# Altium schematic sheet Heated bed.SchDoc: Heated bed
size A4; DrawnBy: oaba200
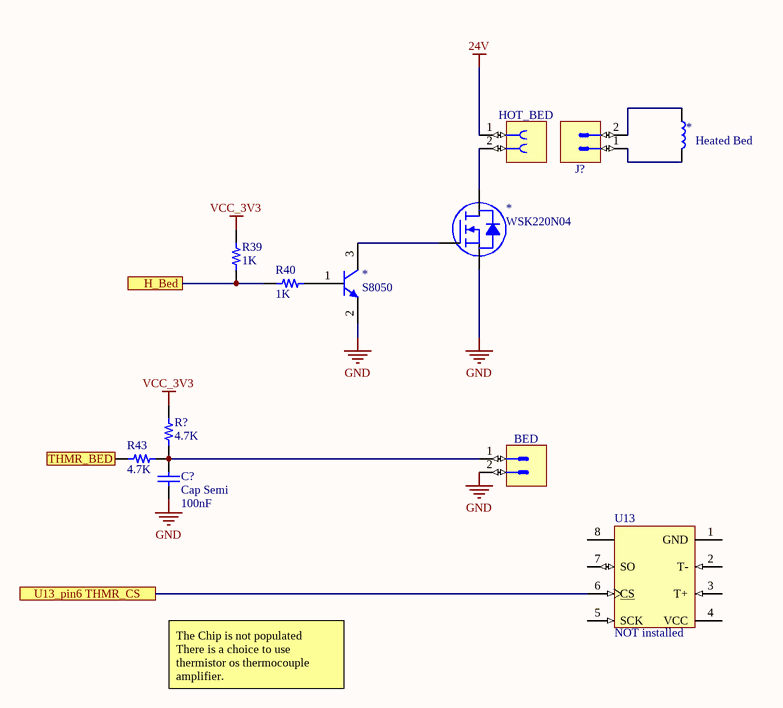
[diagram p0: Heated bed.SchDoc]

## Parts
(Parts that share a designator on the sheet are numbered #1, #2 ... from top to bottom, then left to right.)
*#1  Heated Bed
*#2  WSK220N04  [TO263]
*#3  S8050  [SOT23]
BED  (no value)
C?  Cap Semi  value 100nF  [C1206]
HOT_BED  (no value)
J?  (no value)
R39  1K
R40  1K
R43  4.7K  [RES 0805_2012]
R?  4.7K  [RES 0805_2012]
U13  NOT installed  [SOIC8]

## Ports
H_Bed, THMR_BED, U13_pin6 THMR_CS

## Nets
24V: HOT_BED.1
GND: *#2.2(S) *#3.2(E) BED.2 C?.2
VCC_3V3: R39.2 R?.1
H_Bed: R39.1 R40.1 ; port H_Bed
THMR_BED: R43.1 ; port THMR_BED
U13_pin6 THMR_CS: U13.6(CS) ; port U13_pin6 THMR_CS
Net*#1_1: *#1.1 J?.2
Net*#1_2: *#1.2 J?.1
Net*#2_1: *#2.1(G) *#3.3(C)
Net*#2_3: *#2.3(D) HOT_BED.2
Net*#3_1: *#3.1(B) R40.2
NetBED_1: BED.1 C?.1 R43.2 R?.2

Not connected (* = marked no-connect by the designer): U13 1(GND) 2(T-) 3(T+) 4(VCC) 5(SCK) 7(SO) 8

## Notes on the sheet
- The Chip is not populated
  There is a choice to use thermistor os thermocouple amplifier.
  The output is common with both IC. Only the Chipselest separate.

## Library data of the parts
*#1 = Heater coil
*#2 = WSK220N04: N-Ch MOSFET / 40V  220A
BED J? = Connector 2 Male
C? = Cap Semi: Capacitor (Semiconductor SIM Model); Published: 8-Jun-2000; LatestRevisionDate: 29-May-2009; LatestRevisionNote: IPC-7351 Footprint Added.; PackageReference: C1206; Publisher: Altium Limited; PackageDescription: Chip Capacitor
HOT_BED = Connector 2 Female
R39 R40 R43 R? = Resistor: SMT Resistor
  R43 R?: VALUE: 4.7K
U13 = MAX6675